# EAGLE design pfetreg (EAGLE 7.3.0)
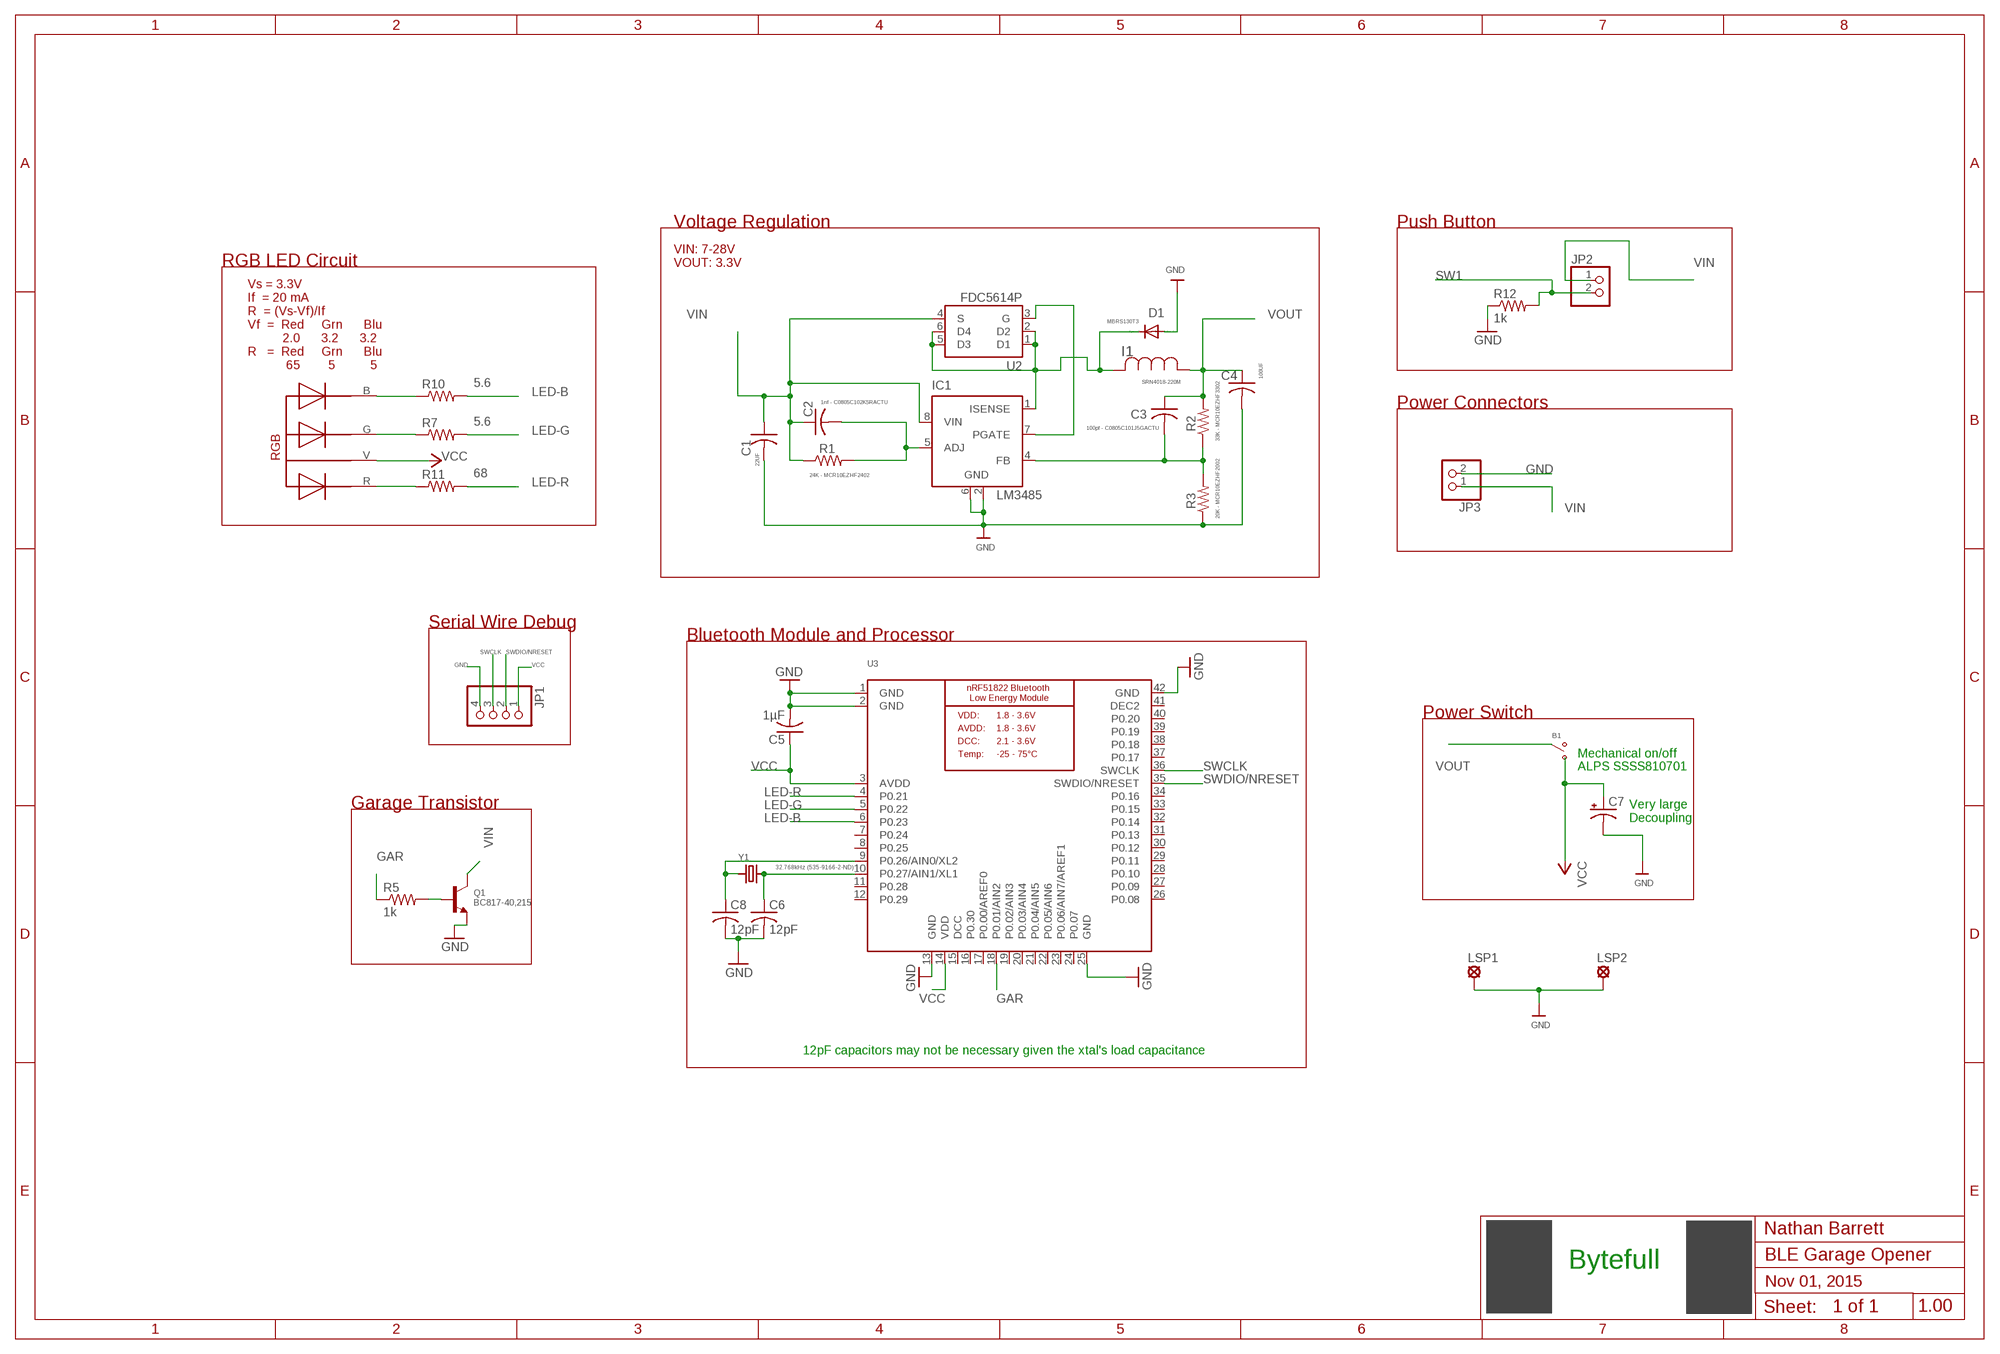
[diagram p0: schematic, sheet 1]

## Parts
B1  SSSS810701  [SSSS810701]
C1  22UF  F931V226MNC  [CAPCP7343X430N]
C2  1nf - C0805C102K5RACTU  C-USC0805K  [C0805K]
C3  100pf - C0805C101J5GACTU  C-USC0805K  [C0805K]
C4  100UF  6TPC100M  [CAPCP7343X430N]
C5  1µF  C-USC0805K  [C0805K]
C6  12pF  C-USC0805  [C0805]
C7  CPOL-USE5-10.5  [E5-10,5]
C8  12pF  C-USC0805  [C0805]
D1  MBRS130T3  DIODE-DO214AA  [DO214AA]
I1  SRN4018-220M  [SRN4018-220M]
IC1  LM3485  [MSOP08]
JP1  PINHD-1X4  [1X04]
JP2  PINHD-1X2  [1X02]
JP3  PINHD-1X2  [1X02]
LSP1  LSP11  [LSP11]
LSP2  LSP11  [LSP11]
Q1  BC817-40,215  TRANSISTOR_NPN  [SOT23-R]
R1  24K - MCR10EZHF2402  R-US_R0805W  [R0805W]
R2  33K - MCR10EZHF3302  R-US_R0805W  [R0805W]
R3  20K - MCR10EZHF2002  R-US_R0805W  [R0805W]
R5  1k  R-US_R0805  [R0805]
R7  5.6  R-US_R0805  [R0805]
R10  5.6  R-US_R0805  [R0805]
R11  68  R-US_R0805  [R0805]
R12  1k  R-US_R0805  [R0805]
RGB  5MMRGBLED  [LED5MMRGB]
U2  FDC5614PSOT-23  [SOT23-6]
U3  NRF51822_MODULE_MDBT40  [BLE_MODULE_RAYTAC_MDBT40]
Y1  CRYSTAL8X3.8SMT  [CRYSTAL_8X3.8]

## Nets
GAR: R5.1 U3.18(P0.01/AIN2)
GND: C1.2(I2) C4.2(I2) C5.2 C6.2 C7.- C8.2 D1.A IC1.2(GND) IC1.6(GND) JP1.4 JP3.2 LSP1.MP LSP2.MP Q1.2(E) R3.1 R12.1 U3.1(GND) U3.2(GND) U3.13(GND) U3.25(GND) U3.42(GND)
LED-B: R10.2 U3.6(P0.23)
LED-G: R7.2 U3.5(P0.22)
LED-R: R11.2 U3.4(P0.21)
N$1: D1.C I1.1(I1) IC1.1(ISENSE) U2.1(D1) U2.2(D2) U2.5(D3) U2.6(D4)
N$2: C3.2 IC1.4(FB) R2.1 R3.2
N$3: IC1.7(PGATE) U2.3(G)
N$4: C2.2 IC1.5(ADJ) R1.2
N$5: Q1.1(B) R5.2
N$6: R7.1 RGB.G
N$7: R10.1 RGB.B
N$8: R11.1 RGB.R
N$11: C8.1 U3.9(P0.26/AIN0/XL2) Y1.P$1
N$16: C6.1 U3.10(P0.27/AIN1/XL1) Y1.P$4
SW1: JP2.2 R12.2
SWCLK: JP1.3 U3.36(SWCLK)
SWDIO/NRESET: JP1.2 U3.35(SWDIO/NRESET)
VCC: B1.1(B) C5.1 C7.+ JP1.1 RGB.V U3.3(AVDD) U3.14(VDD)
VIN: C1.1(I1) C2.1 IC1.8(VIN) JP2.1 JP3.1 Q1.3(C) R1.1 U2.4(S)
VOUT: B1.2(COM) C3.1 C4.1(I1) I1.2(I2) R2.2
Unconnected: B1.3(A) U3.7(P0.24) U3.8(P0.25) U3.11(P0.28) U3.12(P0.29) U3.16(P0.30) U3.17(P0.00/AREF0) U3.19(P0.02/AIN3) U3.20(P0.03/AIN4) U3.21(P0.04/AIN5) U3.22(P0.05/AIN6) U3.23(P0.06/AIN7/AREF1) U3.24(P0.07) U3.26(P0.08) U3.27(P0.09) U3.28(P0.10) U3.29(P0.11) U3.30(P0.12) U3.31(P0.13) U3.32(P0.14) U3.33(P0.15) U3.34(P0.16) U3.37(P0.17) U3.38(P0.18) U3.39(P0.19) U3.40(P0.20)

## Notes on the sheet
- Voltage Regulation | Push Button
- RGB LED Circuit
- VIN: 7-28V
  VOUT: 3.3V
- Vs = 3.3V
  If  = 20 mA
  R  = (Vs-Vf)/If
  Vf  =  Red     Grn      Blu
            2.0      3.2      3.2
  R   =  Red     Grn      Blu
             65        5          5
- Power Connectors
- Serial Wire Debug
- Bluetooth Module and Processor
- Power Switch
- Mechanical on/off
- ALPS SSSS810701
- Garage Transistor
- Very large
  Decoupling
- 32.768kHz (535-9166-2-ND)
- 12pF capacitors may not be necessary given the xtal's load capacitance

## Power pins joined to a net without a drawn wire
DCC: U3.15(DCC)
DEC2: U3.41(DEC2)

## Library data of the parts
B1 = HelloWorld:SSSS810701
C1 = pfetreg:F931V226MNC: Tantalum Capacitor , 2917; CAPACITANCETOLERANCE: ±20%; MPN: F931V226MNC; SUPPLIER: AVX; VOLTAGERATING: 35V
C2 C3 = Bluetooth-Garage:C-US: CAPACITOR, American symbol
C4 = pfetreg:6TPC100M: Poly Capacitor , 2917; CAPACITANCETOLERANCE: ±20%; MPN: 6TPC100M; SUPPLIER: PANASONIC; VOLTAGERATING: 6.3V
C5 C6 C8 = HelloWorld:C-US: CAPACITOR, American symbol
C7 = rcl:CPOL-US: POLARIZED CAPACITOR, American symbol
D1 = diode:DIODE-: DIODE
I1 = pfetreg:SRN4018-220M: FIXED IND 22UH 900MA 348 MOHM SRN4018-220M
IC1 = linear:LM3485: Hysteretic PFET Buck Controller Source: http://cache.national.com/ds/LM/LM3485.pdf
JP1 = HelloWorld:PINHD-1X4: PIN HEADER
JP2 JP3 = pinhead:PINHD-1X2: PIN HEADER
LSP1 LSP2 = solpad:LSP11: SOLDER PAD drill 1.1 mm
Q1 = HelloWorld:TRANSISTOR_NPN: NPN Transistor Transistor (NPN) 500mA 45V - BC817 [Digikey: 568-1631-1-ND] Transistor (NPN) 500mA 45V - BC817,215 [Mouser: 771-BC817-T/R] SOT23-R - SOT23 footprint optimised for use with solder paste and reflow ovens. SOT23-W - SOT23 footprint optimised for hand-soldering (larger pads).
R1-R3 = Bluetooth-Garage:R-US_: RESISTOR, American symbol
R5 R7 R10-R12 = HelloWorld:R-US_: RESISTOR, American symbol
RGB = led_rgb:5MMRGBLED
U2 = pfetreg:FDC5614P: Fairchild P-channel MOSFET -60V FDC5614P , SOT23-6
U3 = HelloWorld:NRF51822_MODULE_MDBT40: nRF51822 Bluetooth Low Energy Module
Y1 = HelloWorld:CRYSTAL: Crystals HC49UP - Surface Mount Crystal 4.0MHz 18pF +/-30ppm Surface Mount Crystal [Digikey: 535-9857-1-ND] 12.0 MHz Surface Mount Crystal [Digikey: 535-9869-6-ND] 25.0 MHz Surface Mount Crystal [Digikey: 535-9078-1-ND] 2.5 x 2.0mm - MEMs SMT Crystal 16.0 MHz 10pF 20ppm 2.5 x 2.0mm Crystal [Digikey -40-85°C: 535-10923-1-ND] 3.2 x 2.5mm - MEMs SMT Crystal 12.0 MHz 8pF 15ppm 3.2 x 2.5mm Crystal [Digikey: -10-70°C: 644-1047-1-ND -40-125°C: 644-1128-1-ND] 16.0 MHz 8pF 15ppm 3.2 x 2.5mm Crystal [Digikey: -10-70°C: 644-1049-1-ND -40-125°C: 644-1129-2-ND] 16.0 MHz 10pF 10ppm 3.2 x 2.5mm Crystal [Digikey: 644-1100-1-ND] 27.12 MHz 18pF 30ppm 3.2 x 2.5mm Crystal [Digikey: 887-1424-1-ND] 27.12MHz 10pF 10ppm 3.2 x 2.5mm Crystal [Digikey: 887-1329-1-ND] 4.9 x 1.8mm - MEMs SMT Crystal 32.768 KHz 12.5pF 20ppm 4.9 x 1.8mm Crystal [Digikey: SE2415CT-ND] 8.0 x 3.8mm - Surface Mount Crystal 32.768kHz 12.5pF 20ppm -40°C-85°C [Digikey: 535-9166-2-ND] Cylinder 32.768KHz Cylinder Crystal (2x6mm body) [Ex. Digikey: 300-8341-2-ND]

## Board
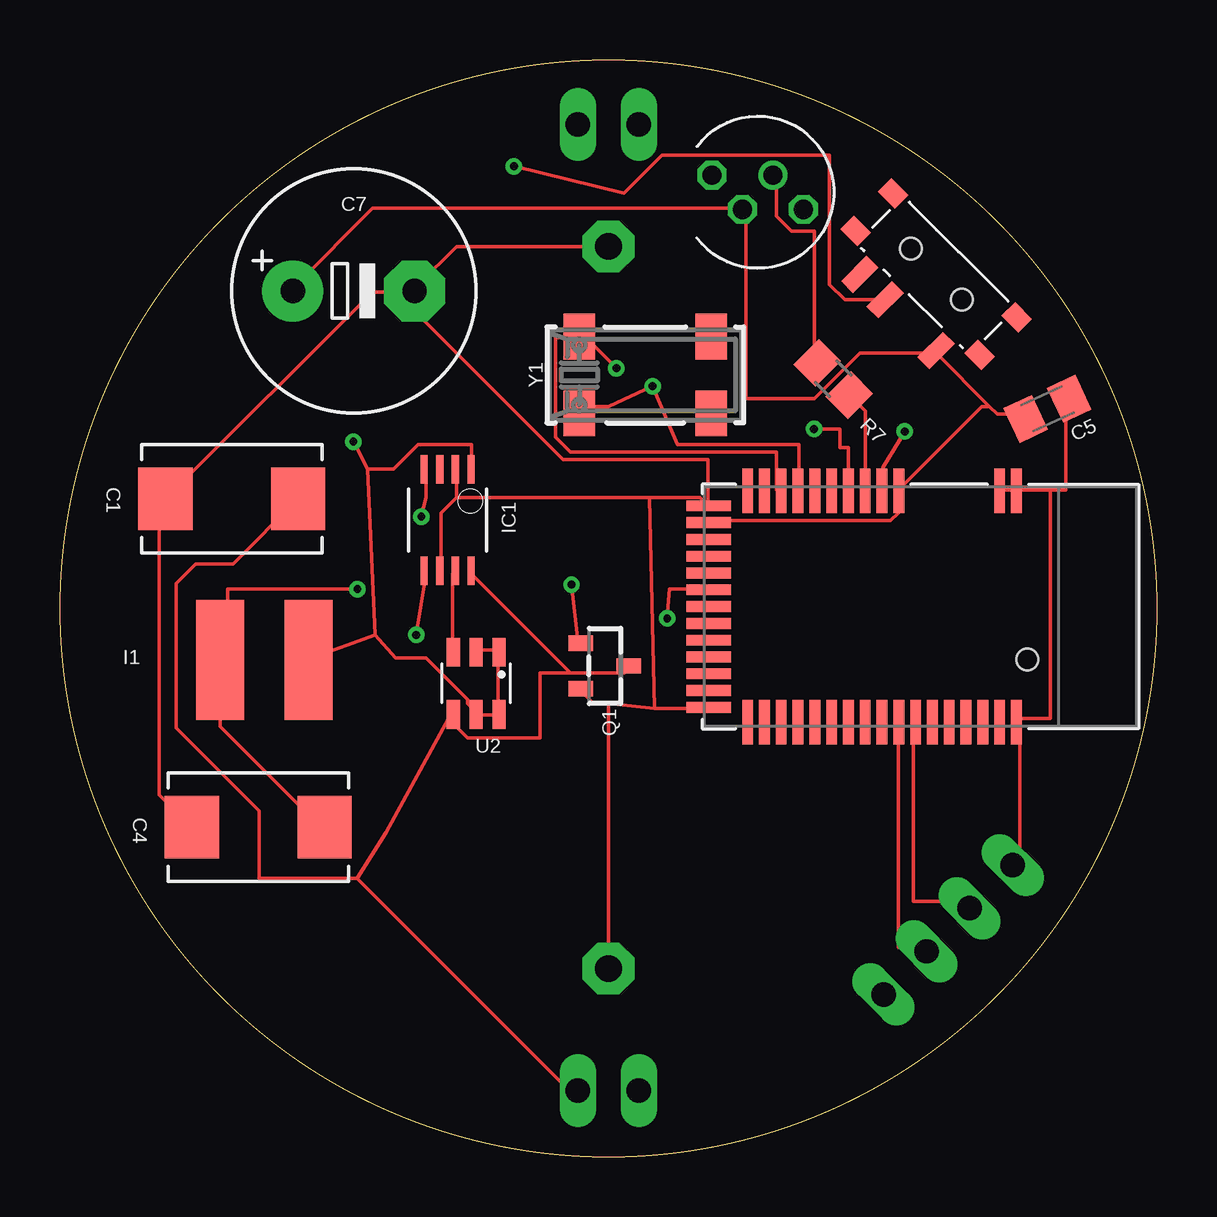
[diagram p1: board, top side]
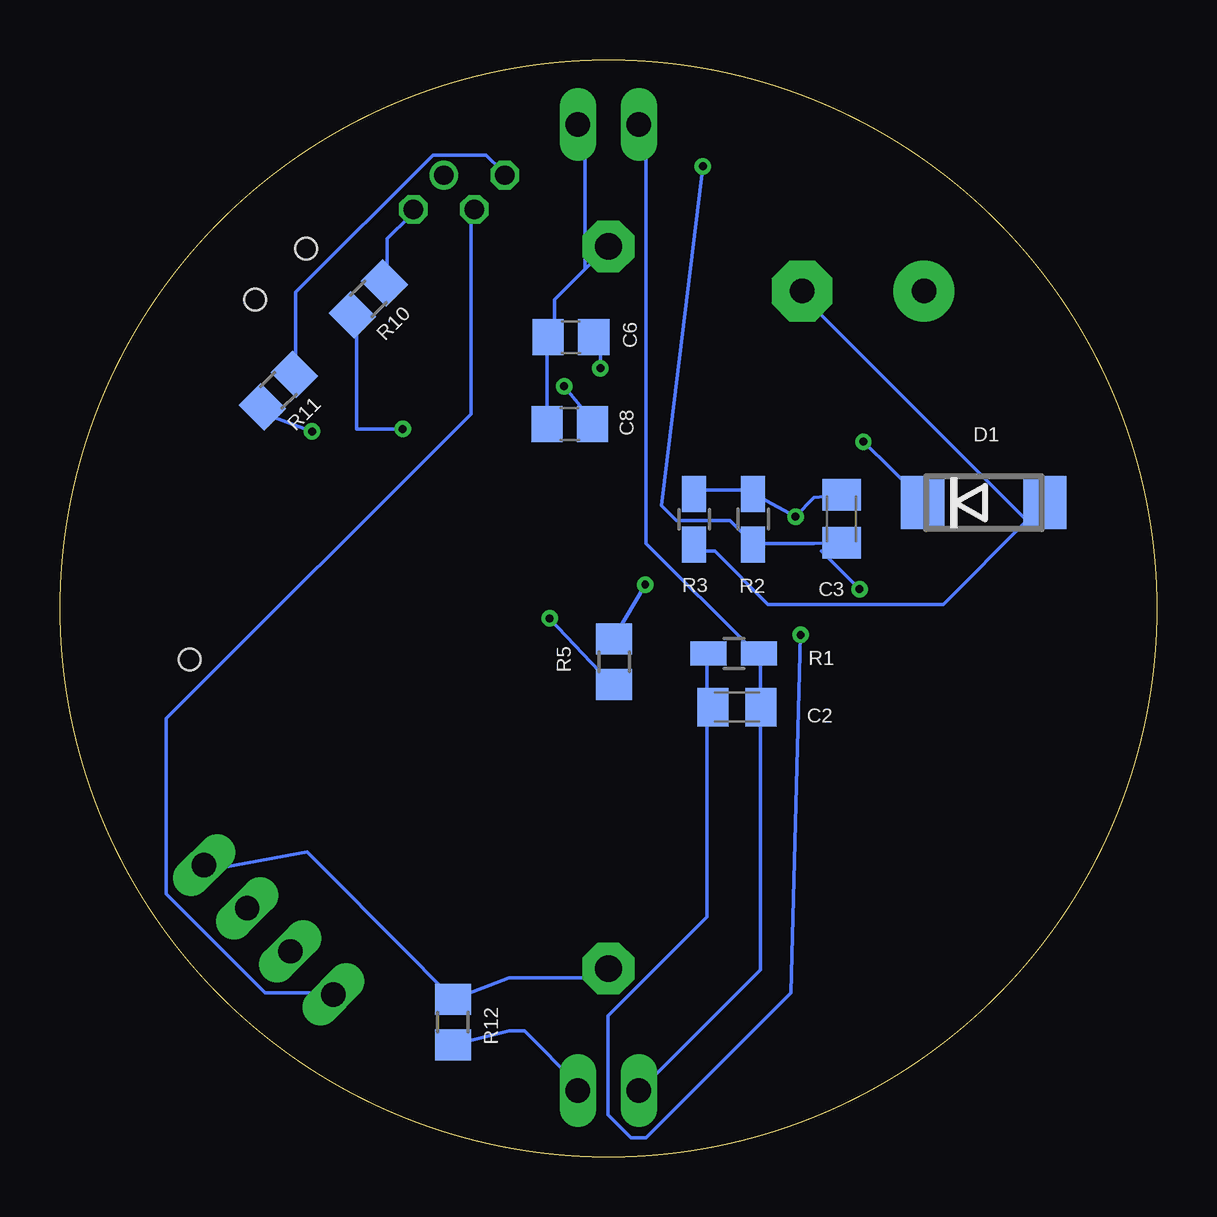
[diagram p2: board, bottom side, seen from below]

Size 45.72 x 45.72 mm. Coordinates in mm from the lower left corner, seen from the top.
Outline: circle at 22.86,22.86 radius 22.86
Copper layers (1*16): Top 0.0356mm / dielectric 1.5011mm / Bottom 0.0356mm
Design rules "oshpark-2layer(2)": minimum track width 6mil, minimum drill 13mil, track to track 6mil, track to pad 6mil, pad to pad 6mil, via to via 6mil, smd to smd 6mil, copper to edge 15mil, drill to drill 6mil, minimum pad ring 7mil, minimum via ring 7mil, stop-mask expansion 4mil, vias tented up to drill 0mil, thermal gap 10mil

### Footprints (pad centres in the part's own frame; a part is rotated, then mirrored left to right if it is on the bottom)
SSSS810701 = smd 0.7 x 1.5: 1 -2.25,2.254; 2 0.75,2.254; 3 2.25,2.254 | smd 1 x 0.8: 4.1 -3.65,1.1; 4.2 3.65,1.1; 4.3 -3.65,-1.1; 4.4 3.65,-1.1 | hole 0.9: 1.5,0; -1.5,0
CAPCP7343X430N = smd 2.261 x 2.591: 1 -2.769,0; 2 2.769,0
C0805K = smd 1.3 x 1.6: 1 -1,0; 2 1,0
C0805 = smd 1.3 x 1.5: 1 -0.95,0; 2 0.95,0
E5-10,5 = drill 1.016 pad 2.54: + -2.54,0 | drill 1.016 pad 2.54 octagon: - 2.54,0
DO214AA = smd 1.8 x 2.2: A 2.55,0; C -2.55,0
SRN4018-220M = smd 1.999 x 5: 1 4.37,0; 2 0.69,0
MSOP08 = smd 0.3 x 1.2: 1 -0.976,-2.113; 2 -0.326,-2.113; 3 0.324,-2.113; 4 0.974,-2.113; 5 0.974,2.112; 6 0.324,2.112; 7 -0.326,2.112; 8 -0.976,2.112
1X04 = drill 1.016 long: 1 -3.81,0; 2 -1.27,0; 3 1.27,0; 4 3.81,0
1X02 = drill 1.016 long: 1 -1.27,0; 2 1.27,0
LSP11 = drill 1.118 pad 2.159 octagon: MP 0,0
SOT23-R = smd 0.635 x 1.016: 1 -0.95,-1; 2 0.95,-1; 3 0,1
R0805W = smd 1.5 x 1: 1 -1.052,0; 2 1.052,0
R0805 = smd 1.3 x 1.5: 1 -0.95,0; 2 0.95,0
LED5MMRGB = drill 0.8 pad 0.813 octagon: B 1.905,-0.714; R -1.905,0.714; V -0.635,-0.714 | drill 0.8 pad 0.813: G 0.635,0.714
SOT23-6 = smd 0.55 x 1.2: 1 0.95,1.3; 2 0,1.3; 3 -0.95,1.3; 4 -0.95,-1.3; 5 0,-1.3; 6 0.95,-1.3
BLE_MODULE_RAYTAC_MDBT40 = smd 1.85 x 0.45: 1 -4.825,4; 2 -4.825,3.3; 3 -4.825,-0.9; 4 -4.825,-1.6; 5 -4.825,-2.3; 6 -4.825,-3; 7 -4.825,-3.7; 8 -4.825,-4.4; 9 -4.825,-5.1; 10 -4.825,-5.8; 11 -4.825,-6.5; 12 -4.825,-7.2; 26 4.825,-7.2; 27 4.825,-6.5; 28 4.825,-5.8; 29 4.825,-5.1; 30 4.825,-4.4; 31 4.825,-3.7; 32 4.825,-3; 33 4.825,-2.3; 34 4.825,-1.6; 35 4.825,-0.9; 36 4.825,-0.2; 37 4.825,0.5; 38 4.825,1.2; 39 4.825,1.9; 40 4.825,2.6; 41 4.825,3.3; 42 4.825,4 | smd 0.45 x 1.85: 13 -4.2,-8.825; 14 -3.5,-8.825; 15 -2.8,-8.825; 16 -2.1,-8.825; 17 -1.4,-8.825; 18 -0.7,-8.825; 19 0,-8.825; 20 0.7,-8.825; 21 1.4,-8.825; 22 2.1,-8.825; 23 2.8,-8.825; 24 3.5,-8.825; 25 4.2,-8.825 | hole 0.9: 2.2,4.45
CRYSTAL_8X3.8 = smd 1.3 x 1.9: P$1 -2.75,-1.6; P$2 2.75,-1.6; P$3 2.75,1.6; P$4 -2.75,1.6

### Placement (x,y rotation side)
B1  36.53,36.79 135 top
C1  7.16,27.43 180 top
C2  17.5,18.75 180 bottom
C3  13.14,26.59 90 bottom
C4  8.27,13.74 180 top
C5  41.16,31.18 25 top
C6  24.42,34.16 180 bottom
C7  12.24,36.09 0 top
C8  24.47,30.54 180 bottom
D1  7.21,27.27 0 bottom
I1  5.99,20.71 0 top
IC1  16.15,26.54 180 top
JP1  37.02,9.46 45 top
JP2  22.86,2.77 0 top
JP3  22.86,43.03 0 top
LSP1  22.86,37.95 0 top
LSP2  22.86,7.85 0 top
Q1  22.71,20.46 270 top
R1  17.63,20.98 180 bottom
R2  16.83,26.58 270 bottom
R3  19.29,26.57 90 bottom
R5  22.62,20.64 90 bottom
R7  32.23,32.42 315 top
R10  32.87,35.76 225 bottom
R11  36.61,31.94 225 bottom
R12  29.34,5.61 270 bottom
RGB  29.08,40.21 0 top
U2  17.35,19.74 0 top
U3  35.86,22.94 270 top
Y1  24.4,32.59 0 top

### Tracks (layer width: path | path; a pad name or v marks a point on that pad's centre or on a via)
GAR  (via drill 0.33)
  Top 0.152: v25.31,22.44 25.41,23.66 27,23.66 U3.18
  Bottom 0.152: v25.31,22.44 22.87,19.85 R5.1
GND
  Top 0.152: 41.29,27.79 40.02,27.79 U3.1 39.7,27.79 39.38,27.79 U3.2 | 41.29,27.79 41.92,27.79 41.92,31.6 C5.2 | JP1.4 40.02,12.23 40.02,17.94 U3.42 40.02,18.26 41.29,18.26 41.29,27.79 | 24.78,18.69 22.87,18.9 | 22.87,18.9 22.24,18.9 21.92,19.22 Q1.2 | 27,18.9 U3.25 27,18.69 24.78,18.69 | 16.52,27.47 15.89,26.84 15.89,24.61 IC1.6 | 16.52,27.47 16.52,28.42 IC1.2 | 27,27.15 26.68,27.47 24.57,27.47 | 16.52,27.47 24.57,27.47 | 24.57,27.47 24.78,18.69 | 22.87,18.9 22.87,8.1 LSP2.MP | C4.2 5.41,13.82 4.14,15.09 4.14,27.15 C1.2 4.46,27.47 13.03,36.04 13.98,36.04 | LSP1.MP 16.52,37.95 14.94,36.36 C7.- | 13.98,36.04 14.62,36.04 C7.- | 27,27.15 27,29.06 20.97,29.06 13.98,36.04 | 27,27.15 U3.13 | 13.98,36.04 C7.-
  Bottom 0.152: LSP2.MP 22.87,7.79 23.19,7.47 27,7.47 R12.1 30.98,8.25 35.42,12.7 39.7,11.91 JP1.4 | 5.41,26.52 4.78,27.15 D1.A 5.41,26.52 | 5.41,26.52 8.9,23.03 16.21,23.03 18.43,25.25 19.06,25.25 R3.1 | C8.2 25.41,30.64 25.41,34.14 C6.2 25.1,34.46 25.1,35.73 23.83,36.99 | 23.83,36.99 22.87,37.95 LSP1.MP | 23.83,36.99 23.83,43.03 JP3.2 | 5.41,26.52 14.94,36.04 C7.-
LED-B  (via drill 0.33)
  Top 0.152: 32.72,27.79 U3.6 32.87,29.57 32.51,29.57 32.51,30.34 v31.43,30.34
  Bottom 0.152: v31.43,30.34 33.35,30.33 33.35,35.09 R10.2
LED-G
  Top 0.152: U3.5 33.58,27.76 33.58,31.08 R7.2
LED-R  (via drill 0.33)
  Top 0.152: U3.4 34.3,27.79 34.3,28.74 v35.22,30.24
  Bottom 0.152: v35.22,30.24 37.16,30.96 R11.2
N$1  (via drill 0.33)
  Top 0.152: 13.13,21.74 12.83,28.66 | 13.13,21.74 10.49,20.8 I1.1 | IC1.1 17.16,28.74 17.16,29.69 14.94,29.69 13.91,28.66 12.83,28.66 | 12.83,28.66 v12.23,29.81 | 13.13,21.74 13.98,20.8 15.25,20.8 17,19.06 17,18.9 17.32,18.58 U2.5 17.48,18.42 18.27,18.42 U2.6 18.27,18.58 18.27,20.96 U2.1 18.11,21.12 17.48,21.12 U2.2
  Bottom 0.152: v12.23,29.81 9.86,27.47 D1.C
N$2  (via drill 0.33)
  Top 0.152: v15.06,26.68 15.25,27.47 15.25,28.42 IC1.4
  Bottom 0.152: R3.2 19.06,27.79 16.84,27.79 R2.1 16.52,27.47 v15.06,26.68 14.3,27.47 C3.2
N$3
  Top 0.152: 16.52,21.12 U2.3 16.36,21.12 16.36,24.29 IC1.7 16.52,24.29
N$4  (via drill 0.33)
  Top 0.152: v14.85,21.76 15.25,24.29 IC1.5
  Bottom 0.152: v14.85,21.76 15.25,6.83 21.29,0.8 21.92,0.8 22.87,1.75 22.87,5.88 18.75,10.01 18.75,18.58 C2.2 18.75,18.9 18.75,20.8 R1.2
N$5  (via drill 0.33)
  Top 0.152: v21.32,23.85 21.6,21.44 Q1.1
  Bottom 0.152: v21.32,23.85 22.56,21.76 R5.2
N$6
  Top 0.152: R7.1 31.45,33.18 31.45,38.58 30.49,38.58 29.86,39.22 29.86,40.81 RGB.G
N$7
  Bottom 0.152: R10.1 32.08,36.68 32.08,38.27 31.13,39.22 RGB.B
N$8
  Bottom 0.152: R11.1 35.89,32.87 35.89,36.04 30.18,41.76 27.95,41.76 27.32,41.12 RGB.R
N$11  (via drill 0.33)
  Top 0.152: Y1.P$1 21.92,31.28 22.87,31.28 v24.7,32.12 25.73,29.69 30.81,29.69 30.81,27.79 U3.9
  Bottom 0.152: v24.7,32.12 23.51,30.64 C8.1
N$16  (via drill 0.33)
  Top 0.152: v23.19,32.87 21.92,34.14 Y1.P$4 21.6,34.14 20.65,34.14 20.65,30.01 21.29,29.38 29.86,29.38 29.86,27.79 U3.10
  Bottom 0.152: v23.19,32.87 23.19,34.14 C6.1
SW1
  Bottom 0.152: R12.2 27,5.24 26.37,5.24 24.14,3.02 JP2.2
SWCLK
  Top 0.152: U3.36 35.57,17.94 35.57,10.64 37.8,10.64 JP1.3
SWDIO/NRESET
  Top 0.152: U3.35 34.94,17.94 34.94,8.74 35.89,8.74 JP1.2
VCC
  Top 0.152: U3.14 27.32,26.52 34.62,26.52 34.94,26.84 34.94,27.47 U3.3 34.94,27.79 38.43,31.28 38.75,31.28 | 38.75,31.28 39.07,30.96 40.02,30.96 C5.1 | 38.75,31.28 36.53,33.5 B1.1 36.21,33.5 33.35,33.5 31.45,31.6 28.59,31.6 28.59,39.22 RGB.V 28.27,39.53 13.03,39.53 9.86,36.36 C7.+
  Bottom 0.152: JP1.1 34.62,6.83 37.16,6.83 41.29,10.96 41.29,18.26 28.59,30.96 28.59,39.22 RGB.V
VIN
  Top 0.152: 21.29,20.17 20.02,20.17 20.02,17.47 17,17.47 16.21,18.26 | 21.29,20.17 23.51,20.17 Q1.3 | 21.29,20.17 17.16,24.29 IC1.8 | 9.86,27.15 C1.1 7.21,24.71 5.66,24.71 4.85,23.9 4.85,17.88 8.31,14.43 8.31,11.6 12.4,11.6 | 12.4,11.6 20.97,3.02 21.29,3.02 JP2.1 | 16.21,18.26 13.59,13.51 12.4,11.6 | 16.21,18.26 16.36,18.42 U2.4 16.21,18.26
  Bottom 0.152: JP2.1 21.29,3.02 16.52,7.79 16.52,18.58 C2.1 16.52,18.9 16.52,20.8 R1.1 16.84,21.12 21.29,25.56 21.29,43.03 JP3.1
VOUT  (via drill 0.33)
  Top 0.152: C4.1 10.81,13.82 6.68,17.94 6.68,20.49 I1.2 7,20.8 7,23.66 v12.4,23.66 | v18.92,41.29 23.51,40.17 25.1,41.76 32.08,41.76 32.08,36.36 32.72,35.73 34.3,35.73 B1.2
  Bottom 0.152: v18.92,41.29 20.65,27.15 20.02,26.52 17.79,26.52 16.84,25.56 R2.2 16.52,25.56 14.3,25.56 C3.1 13.98,25.25 v12.4,23.66